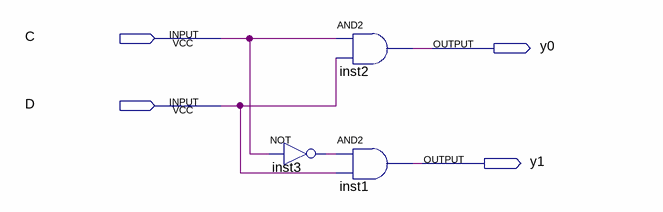
[diagram p0: schematic sheet]
// Quartus schematic demultiplexer.bdf as structural Verilog: 3 symbols, 4 pins
module demultiplexer (
  input  C,
  input  D,
  output y0,
  output y1
);

  wire inst3_out;

  not inst3 (inst3_out, C);
  and inst2 (y0, C, D);
  and inst1 (y1, inst3_out, D);
endmodule
